# EAGLE schematic Atmega1284P_New (EAGLE 9.6.0)
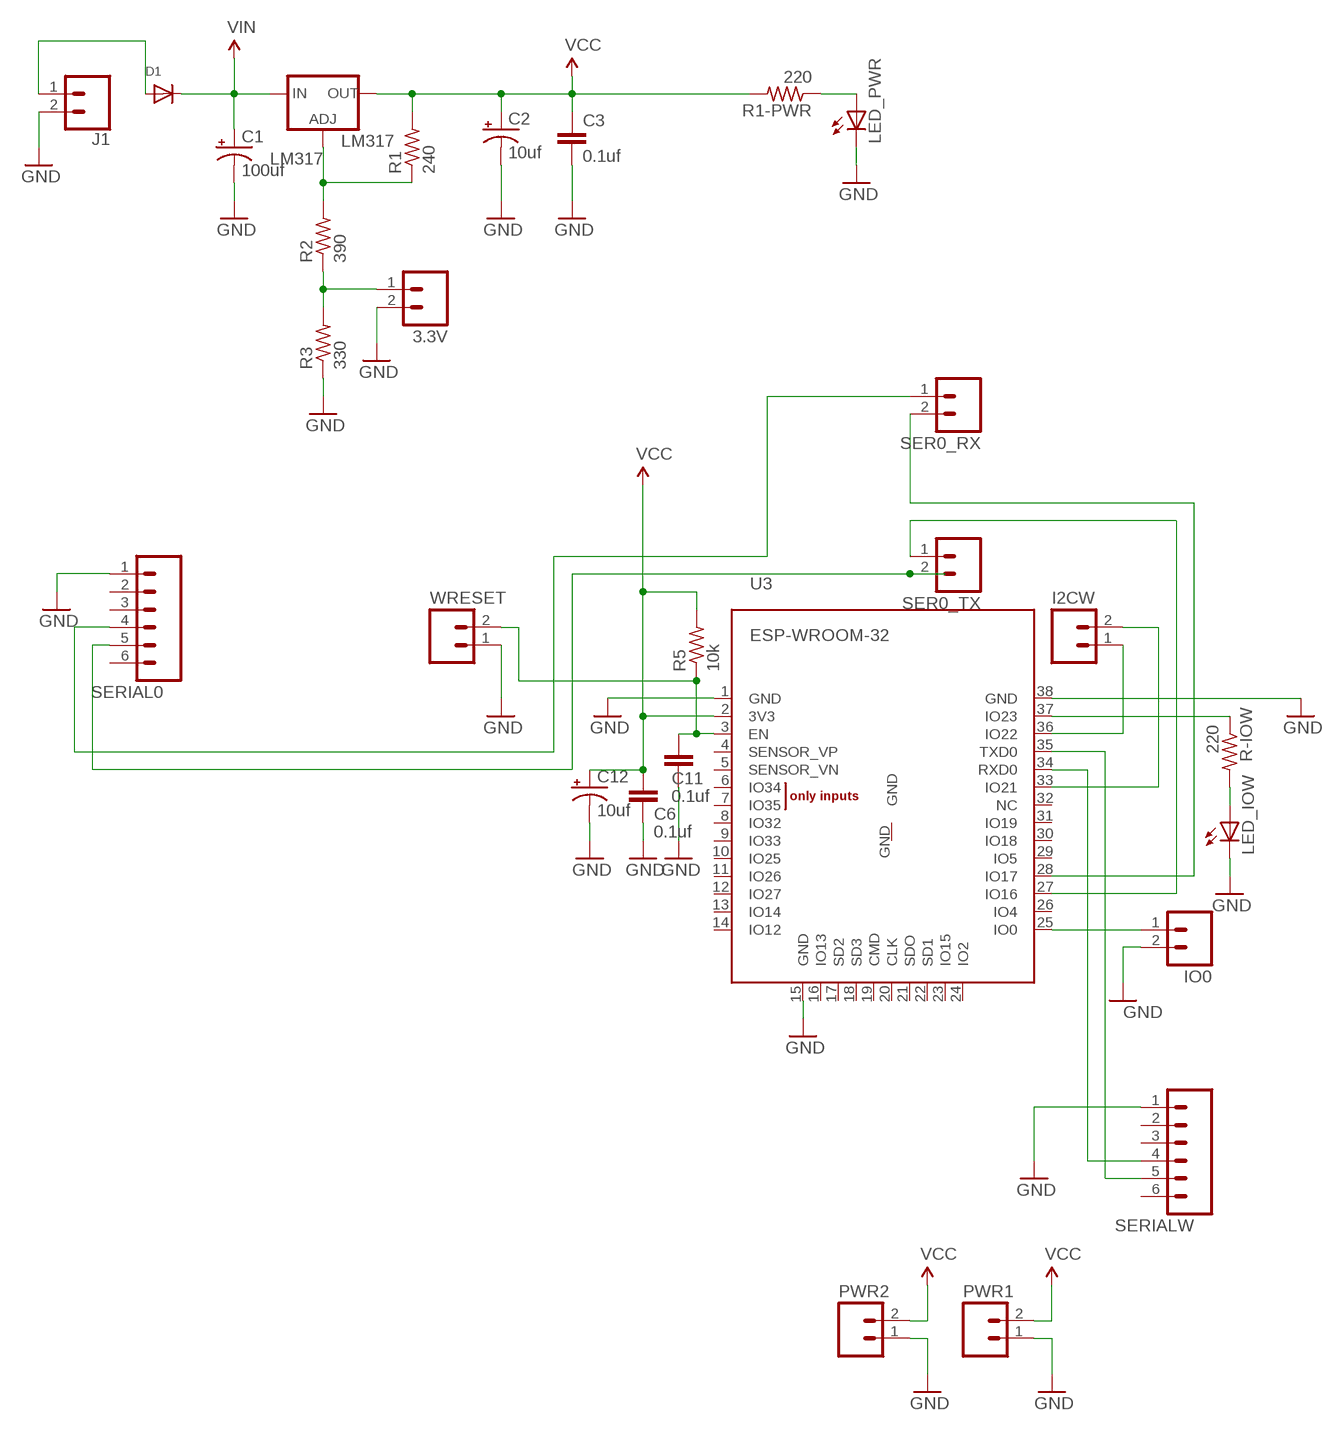
[diagram p0: schematic, sheet 1]

## Parts
3.3V  M02PTH  [1X02@1]
C1  100uf  CAP_POLD  [PANASONIC_D]
C2  10uf  CAP_POLD  [PANASONIC_D]
C3  0.1uf  CAP0805  [0805]
C6  0.1uf  CAP0805  [0805]
C11  0.1uf  CAP0805  [0805]
C12  10uf  CAP_POLD  [PANASONIC_D]
D1  DIODE_SOD-123FL  [SOD-123FL]
I2CW  M02PTH  [1X02@1]
IO0  M02PTH  [1X02@1]
J1  CONN_023.5MM  [SCREWTERMINAL-3.5MM-2]
LED_IOW  LEDCHIPLED_0805  [CHIPLED_0805]
LED_PWR  LEDCHIPLED_0805  [CHIPLED_0805]
LM317  LM317  V_REG_317SMD  [SOT223]
PWR1  M02PTH  [1X02@1]
PWR2  M02PTH  [1X02@1]
R1  240  R-US_R0805  [R0805]
R1-PWR  220  R-US_R0805  [R0805]
R2  390  R-US_R0805  [R0805]
R3  330  R-US_R0805  [R0805]
R5  10k  R-US_R0805  [R0805]
R-IOW  220  R-US_R0805  [R0805]
SER0_RX  M02PTH  [1X02@1]
SER0_TX  M02PTH  [1X02@1]
SERIAL0  M06SILK_FEMALE_PTH  [1X06]
SERIALW  M06SILK_FEMALE_PTH  [1X06]
U3  ESP-WROOM-32  [ESP-WROOM-32]
WRESET  M02PTH  [1X02@1]

## Nets
GND [supply]: 3.3V.2 C1.- C2.- C3.2 C6.2 C11.2 C12.- IO0.2 J1.2 LED_IOW.C LED_PWR.C PWR1.1 PWR2.1 R3.1 SERIAL0.1 SERIALW.1 U3.1(GND) U3.15(GND) U3.38(GND) WRESET.1
N$1: 3.3V.1 R2.1 R3.2
N$3: SER0_RX.1 SERIAL0.4
N$5: SER0_TX.2 SERIAL0.5
N$13: LM317.1(ADJ) R1.1 R2.2
N$41: LED_PWR.A R1-PWR.1
N$42: C11.1 R5.1 U3.3(EN) WRESET.2
N$43: IO0.1 U3.25(IO0)
N$44: SERIALW.4 U3.34(RXD0)
N$45: SERIALW.5 U3.35(TXD0)
N$46: R-IOW.1 U3.37(IO23)
N$47: LED_IOW.A R-IOW.2
N$48: I2CW.2 U3.33(IO21)
N$49: I2CW.1 U3.36(IO22)
N$50: SER0_RX.2 U3.28(IO17)
N$51: D1.A J1.1
N$53: SER0_TX.1 U3.27(IO16)
VCC: C2.+ C3.1 C6.1 C12.+ LM317.2(OUT) PWR1.2 PWR2.2 R1-PWR.2 R1.2 R5.2 U3.2(3V3)
VIN: C1.+ D1.C LM317.3(IN)
Unconnected: SERIAL0.2 SERIAL0.3 SERIAL0.6 SERIALW.2 SERIALW.3 SERIALW.6 U3.4(SENSOR_VP) U3.5(SENSOR_VN) U3.6(IO34) U3.7(IO35) U3.8(IO32) U3.9(IO33) U3.10(IO25) U3.11(IO26) U3.12(IO27) U3.13(IO14) U3.14(IO12) U3.16(IO13) U3.17(SD2) U3.18(SD3) U3.19(CMD) U3.20(CLK) U3.21(SDO) U3.22(SD1) U3.23(IO15) U3.24(IO2) U3.26(IO4) U3.29(IO5) U3.30(IO18) U3.31(IO19) U3.32(NC) U3.GND

## Library data of the parts
3.3V I2CW IO0 PWR1 PWR2 SER0_RX SER0_TX WRESET = SparkFun-Connectors:M02: Standard 2-pin 0.1" header. Use with - straight break away headers ( PRT-00116) - right angle break away headers (PRT-00553) - swiss pins (PRT-00743) - machine pins (PRT-00117) - female headers (PRT-00115) Molex polarized connector foot print use with: PRT-08233 with associated crimp pins and housings. 2.54_SCREWTERM for use with PRT-10571. 3.5mm Screw Terminal footprints for PRT-08084 5mm Screw Terminal footprints for use with PRT-08432
C1 C2 C12 = SparkFun-Capacitors:CAP_POL: Capacitor Polarized These are standard SMD and PTH capacitors. Normally 10uF, 47uF, and 100uF in electrolytic and tantalum varieties. Always verify the external diameter of the through hole cap, it varies with capacity, voltage, and manufacturer. The EIA devices should be standard.
C3 C6 C11 = SparkFun-Passives:CAP: Capacitor Standard 0603 ceramic capacitor, and 0.1" leaded capacitor.
D1 = adafruit:DIODE: Diode SMADIODE - SMA Surface Mount Package 20V 1A Schottky Diode Digikey: 641-1014-6-ND DO-1N4148 - Through Hole Small Current Diode SOD-123 20V 1 A (.5mV Vf) Schottky Diode - Digikey: MBRX120TPMSCT-ND SOD-323 10V 570mA (.38mV Vf, 3ns) Schottky Diode - Digikey: ZLLS410CT-ND SOD-523 30V 30mA Schottky Diode (RB751S-40TE61) - Digikey: RB751S-40TE61CT-ND SOT23-R/W - SOT23 Package (R = Solder Paste/Reflow Ovens, W = Hand-Soldering) BAT54Film 40V 300mA - Digikey: 497-7162-1-ND
J1 = SparkFun-Retired:CONN_02: Multi connection point. Often used as Generic Header-pin footprint for 0.1 inch spaced/style header connections On any of the 0.1 inch spaced packages, you can populate with these: Break Away Headers - Straight <https://www.sparkfun.com/products/116> (PRT-00116) Break Away Male Headers - Right Angle <https://www.sparkfun.com/products/553> (PRT-00553) Female Headers <https://www.sparkfun.com/products/115> (PRT-00115) Break Away Headers - Machine Pin <https://www.sparkfun.com/products/117> (PRT-00117) Break Away Female Headers - Swiss Machine Pin <https://www.sparkfun.com/products/743> (PRT-00743) For SCREWTERMINALS and SPRING TERMINALS visit here: Screw Terimnals on SparkFun.com <https://www.sparkfun.com/search/results?term=Screw+Terminals> (5mm/3.5mm/2.54mm spacing) This device is also useful as a general connection point to wire up your design to another part of your project. Our various solder wires solder well into these plated through hole pads. Hook-Up Wire - Assortment (Stranded, 22 AWG) <https://www.sparkfun.com/products/11375> (PRT-11375) Hook-Up Wire - Assortment (Solid Core, 22 AWG) <https://www.sparkfun.com/products/11367> (PRT-11367) View the entire wire category on our website here <https://www.sparkfun.com/categories/141> Special notes: Molex polarized connector foot print use with: PRT-08233 with associated crimp pins and housings. 2.54_SCREWTERM for use with PRT-10571. 3.5mm Screw Terminal footprints for PRT-08084 5mm Screw Terminal footprints for use with PRT-08432; PROD_ID: CONN-08399
LED_IOW LED_PWR = adafruit:LED: LED OSRAM: - CHIPLED LG R971, LG N971, LY N971, LG Q971, LY Q971, LO R971, LY R971 LH N974, LH R974 LS Q976, LO Q976, LY Q976 LO Q996 - Hyper CHIPLED LW Q18S LB Q993, LB Q99A, LB R99A - SideLED LS A670, LO A670, LY A670, LG A670, LP A670 LB A673, LV A673, LT A673, LW A673 LH A674 LY A675 LS A676, LA A676, LO A676, LY A676, LW A676 LS A679, LY A679, LG A679 - Hyper Micro SIDELED® LS Y876, LA Y876, LO Y876, LY Y876 LT Y87S - SmartLED LW L88C, LW L88S LB L89C, LB L89S, LG L890 LS L89K, LO L89K, LY L89K LS L896, LA L896, LO L896, LY L896 - TOPLED LS T670, LO T670, LY T670, LG T670, LP T670 LSG T670, LSP T670, LSY T670, LOP T670, LYG T670 LG T671, LOG T671, LSG T671 LB T673, LV T673, LT T673, LW T673 LH T674 LS T676, LA T676, LO T676, LY T676, LB T676, LH T676, LSB T676, LW T676 LB T67C, LV T67C, LT T67C, LS T67K, LO T67K, LY T67K, LW E67C LS E67B, LA E67B, LO E67B, LY E67B, LB E67C, LV E67C, LT E67C LW T67C LS T679, LY T679, LG T679 LS T770, LO T770, LY T770, LG T770, LP T770 LB T773, LV T773, LT T773, LW T773 LH T774 LS E675, LA E675, LY E675, LS T675 LS T776, LA T776, LO T776, LY T776, LB T776 LHGB T686 LT T68C, LB T68C - Hyper Mini TOPLED® LB M676 - Mini TOPLED Santana® LG M470 LS M47K, LO M47K, LY M47K Source: http://www.osram.convergy.de/
LM317 = SparkFun-PowerIC:V_REG_317: Voltage Regulator Standard LM317 adjustable voltage regulator. AOI (Adjust Output Input). Google 'LM317 Calculator' for easy to use app to get the two resistor values needed. 240/720 for 5V output. 240/390 for 3.3V output. Spark Fun Electronics SKU : COM-00527
R1 R1-PWR R2 R3 R5 R-IOW = resistor:R-US_: RESISTOR, American symbol
SERIAL0 SERIALW = SparkFun-Connectors:M06: Header 6 Standard 6-pin 0.1" header. Use with straight break away headers (SKU : PRT-00116), right angle break away headers (PRT-00553), swiss pins (PRT-00743), machine pins (PRT-00117), and female headers (PRT-00115). Molex polarized connector foot print use with SKU : PRT-08094 with associated crimp pins and housings. NOTES ON THE VARIANTS LOCK and LOCK_LONGPADS... This footprint was designed to help hold the alignment of a through-hole component (i.e. 6-pin header) while soldering it into place. You may notice that each hole has been shifted either up or down by 0.005 of an inch from it's more standard position (which is a perfectly straight line). This slight alteration caused the pins (the squares in the middle) to touch the edges of the holes. Because they are alternating, it causes a "brace" to hold the component in place. 0.005 has proven to be the perfect amount of "off-center" position when using our standard breakaway headers. Although looks a little odd when you look at the bare footprint, once you have a header in there, the alteration is very hard to notice. Also,if you push a header all the way into place, it is covered up entirely on the bottom side. This idea of altering the position of holes to aid alignment will be further integrated into the Sparkfun Library for other footprints. It can help hold any component with 3 or more connection pins.; PROD_ID: CONN-08437
U3 = esp32:ESP-WROOM-32

## Net classes
0 default: width 0.254 mm, clearance 0.254 mm
1 supply: width 0.254 mm, clearance 0.254 mm